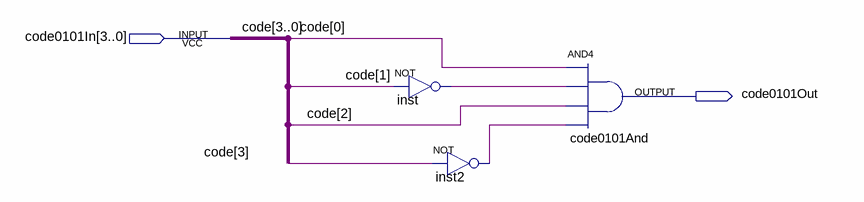
[diagram p0: schematic sheet]
// Quartus schematic code0101.bdf as structural Verilog: 3 symbols, 2 pins
module code0101 (
  input  [3:0] code0101In,
  output code0101Out
);

  wire inst2_out, inst_out;

  not inst (inst_out, code0101In[1]);
  not inst2 (inst2_out, code0101In[3]);
  and code0101And (code0101Out, code0101In[0], inst_out, code0101In[2], inst2_out);

  // Other names for the same wires on the sheet: code[3:0] = code0101In
endmodule
